# Altium schematic sheet PROTOTYPE_A.SchDoc: User Prototyping Area
size A4; Organization: Altium Limited.; Address1: Level 3, 12a Rodborough Rd; Address2: Frenchs Forest 2086; Address3: NSW; Address4: AUSTRALIA; DocumentNumber: 61; SheetNumber: 62; SheetTotal: 78
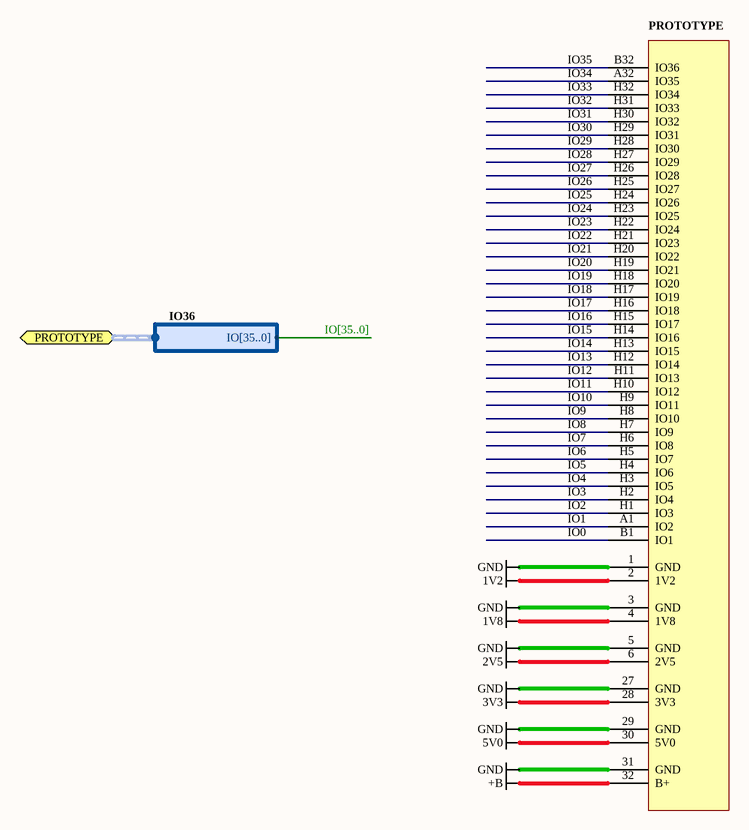
[diagram p0: PROTOTYPE_A.SchDoc]

## Parts
PROTOTYPE  (no value)  [TESTPOINT_ARRAY]  (no BOM)

## Ports
PROTOTYPE (harness IO36)

## Harnesses
IO36: IO[35..0]

## Nets
1V2: PROTOTYPE.2(1V2)
1V8: PROTOTYPE.4(1V8)
2V5: PROTOTYPE.6(2V5)
3V3: PROTOTYPE.28(3V3)
5V0: PROTOTYPE.30(5V0)
+B: PROTOTYPE.32(B+)
GND: PROTOTYPE.1(GND) PROTOTYPE.3(GND) PROTOTYPE.5(GND) PROTOTYPE.27(GND) PROTOTYPE.29(GND) PROTOTYPE.31(GND)
IO0: PROTOTYPE.B1(IO1)
IO1: PROTOTYPE.A1(IO2)
IO2: PROTOTYPE.H1(IO3)
IO3: PROTOTYPE.H2(IO4)
IO4: PROTOTYPE.H3(IO5)
IO5: PROTOTYPE.H4(IO6)
IO6: PROTOTYPE.H5(IO7)
IO7: PROTOTYPE.H6(IO8)
IO8: PROTOTYPE.H7(IO9)
IO9: PROTOTYPE.H8(IO10)
IO10: PROTOTYPE.H9(IO11)
IO11: PROTOTYPE.H10(IO12)
IO12: PROTOTYPE.H11(IO13)
IO13: PROTOTYPE.H12(IO14)
IO14: PROTOTYPE.H13(IO15)
IO15: PROTOTYPE.H14(IO16)
IO16: PROTOTYPE.H15(IO17)
IO17: PROTOTYPE.H16(IO18)
IO18: PROTOTYPE.H17(IO19)
IO19: PROTOTYPE.H18(IO20)
IO20: PROTOTYPE.H19(IO21)
IO21: PROTOTYPE.H20(IO22)
IO22: PROTOTYPE.H21(IO23)
IO23: PROTOTYPE.H22(IO24)
IO24: PROTOTYPE.H23(IO25)
IO25: PROTOTYPE.H24(IO26)
IO26: PROTOTYPE.H25(IO27)
IO27: PROTOTYPE.H26(IO28)
IO28: PROTOTYPE.H27(IO29)
IO29: PROTOTYPE.H28(IO30)
IO30: PROTOTYPE.H29(IO31)
IO31: PROTOTYPE.H30(IO32)
IO32: PROTOTYPE.H31(IO33)
IO33: PROTOTYPE.H32(IO34)
IO34: PROTOTYPE.A32(IO35)
IO35: PROTOTYPE.B32(IO36)

## Buses and harness runs
bus IO[35..0]

## Notes on the sheet
- Sheet Title
- Project Title
- Size:
- Date:
- A4
- Assy:
- Time:
- Revision:
- Sheet
- of
- File:

## Library data of the parts
PROTOTYPE = D-006-0002: Test Point Array; Status: Unreleased; Category: Test-Point